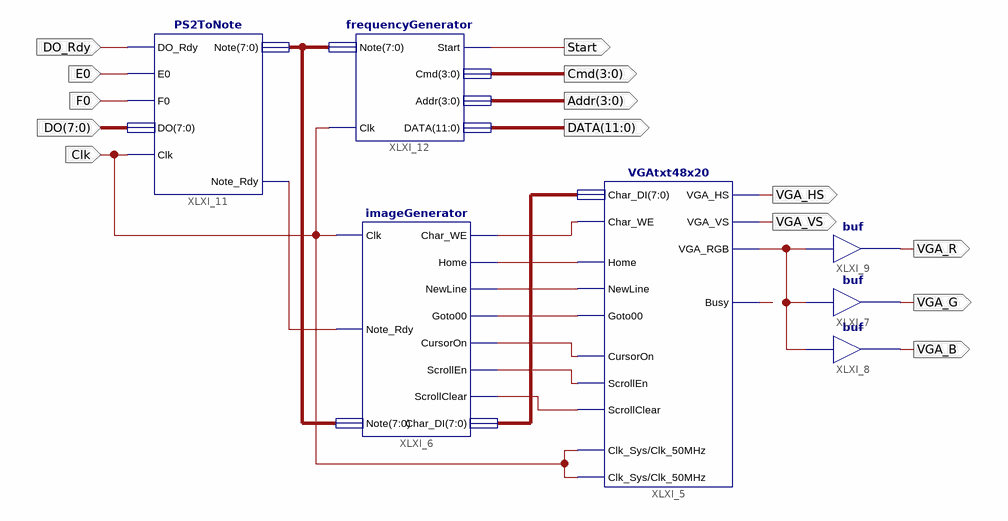
[diagram p0: schematic sheet 1]
// Xilinx ISE schematic MainComponent.sch (spartan3e) as structural Verilog: 7 symbols, 14 ports
module MainComponent (
  input  F0,
  input  E0,
  input  DO_Rdy,
  input  [7:0] DO,
  input  Clk,
  output Start,
  output [3:0] Cmd,
  output [3:0] Addr,
  output [11:0] DATA,
  output VGA_HS,
  output VGA_VS,
  output VGA_B,
  output VGA_G,
  output VGA_R
);

  wire Busy, XLXN_49, XLXN_51, XLXN_53, XLXN_54, XLXN_55, XLXN_56, XLXN_57, XLXN_67, XLXN_72;
  wire [7:0] XLXN_47, XLXN_52;

  PS2ToNote XLXI_11 (.DO_Rdy(DO_Rdy), .E0(E0), .F0(F0), .Note_Rdy(XLXN_49), .Note(XLXN_47), .DO(DO), .Clk(Clk));
  frequencyGenerator XLXI_12 (.Start(Start), .Cmd(Cmd), .Addr(Addr), .DATA(DATA), .Note(XLXN_47), .Clk(Clk));
  VGAtxt48x20 XLXI_5 (
    .Char_DI(XLXN_52), .Home(XLXN_53), .NewLine(XLXN_54), .Goto00(XLXN_55), .Clk_Sys(Clk), .Clk_50MHz(Clk),
    .CursorOn(XLXN_56), .ScrollEn(XLXN_57), .ScrollClear(XLXN_67), .Busy(Busy), .VGA_HS(VGA_HS),
    .VGA_VS(VGA_VS), .VGA_RGB(XLXN_72), .Char_WE(XLXN_51));
  imageGenerator XLXI_6 (
    .Clk(Clk), .Note_Rdy(XLXN_49), .Note(XLXN_47), .Char_WE(XLXN_51), .Home(XLXN_53), .NewLine(XLXN_54),
    .Goto00(XLXN_55), .CursorOn(XLXN_56), .ScrollEn(XLXN_57), .ScrollClear(XLXN_67), .Char_DI(XLXN_52));
  buf XLXI_9 (VGA_R, XLXN_72);
  buf XLXI_8 (VGA_B, XLXN_72);
  buf XLXI_7 (VGA_G, XLXN_72);
endmodule
